# EAGLE schematic ouijabot (EAGLE 9.4.2)
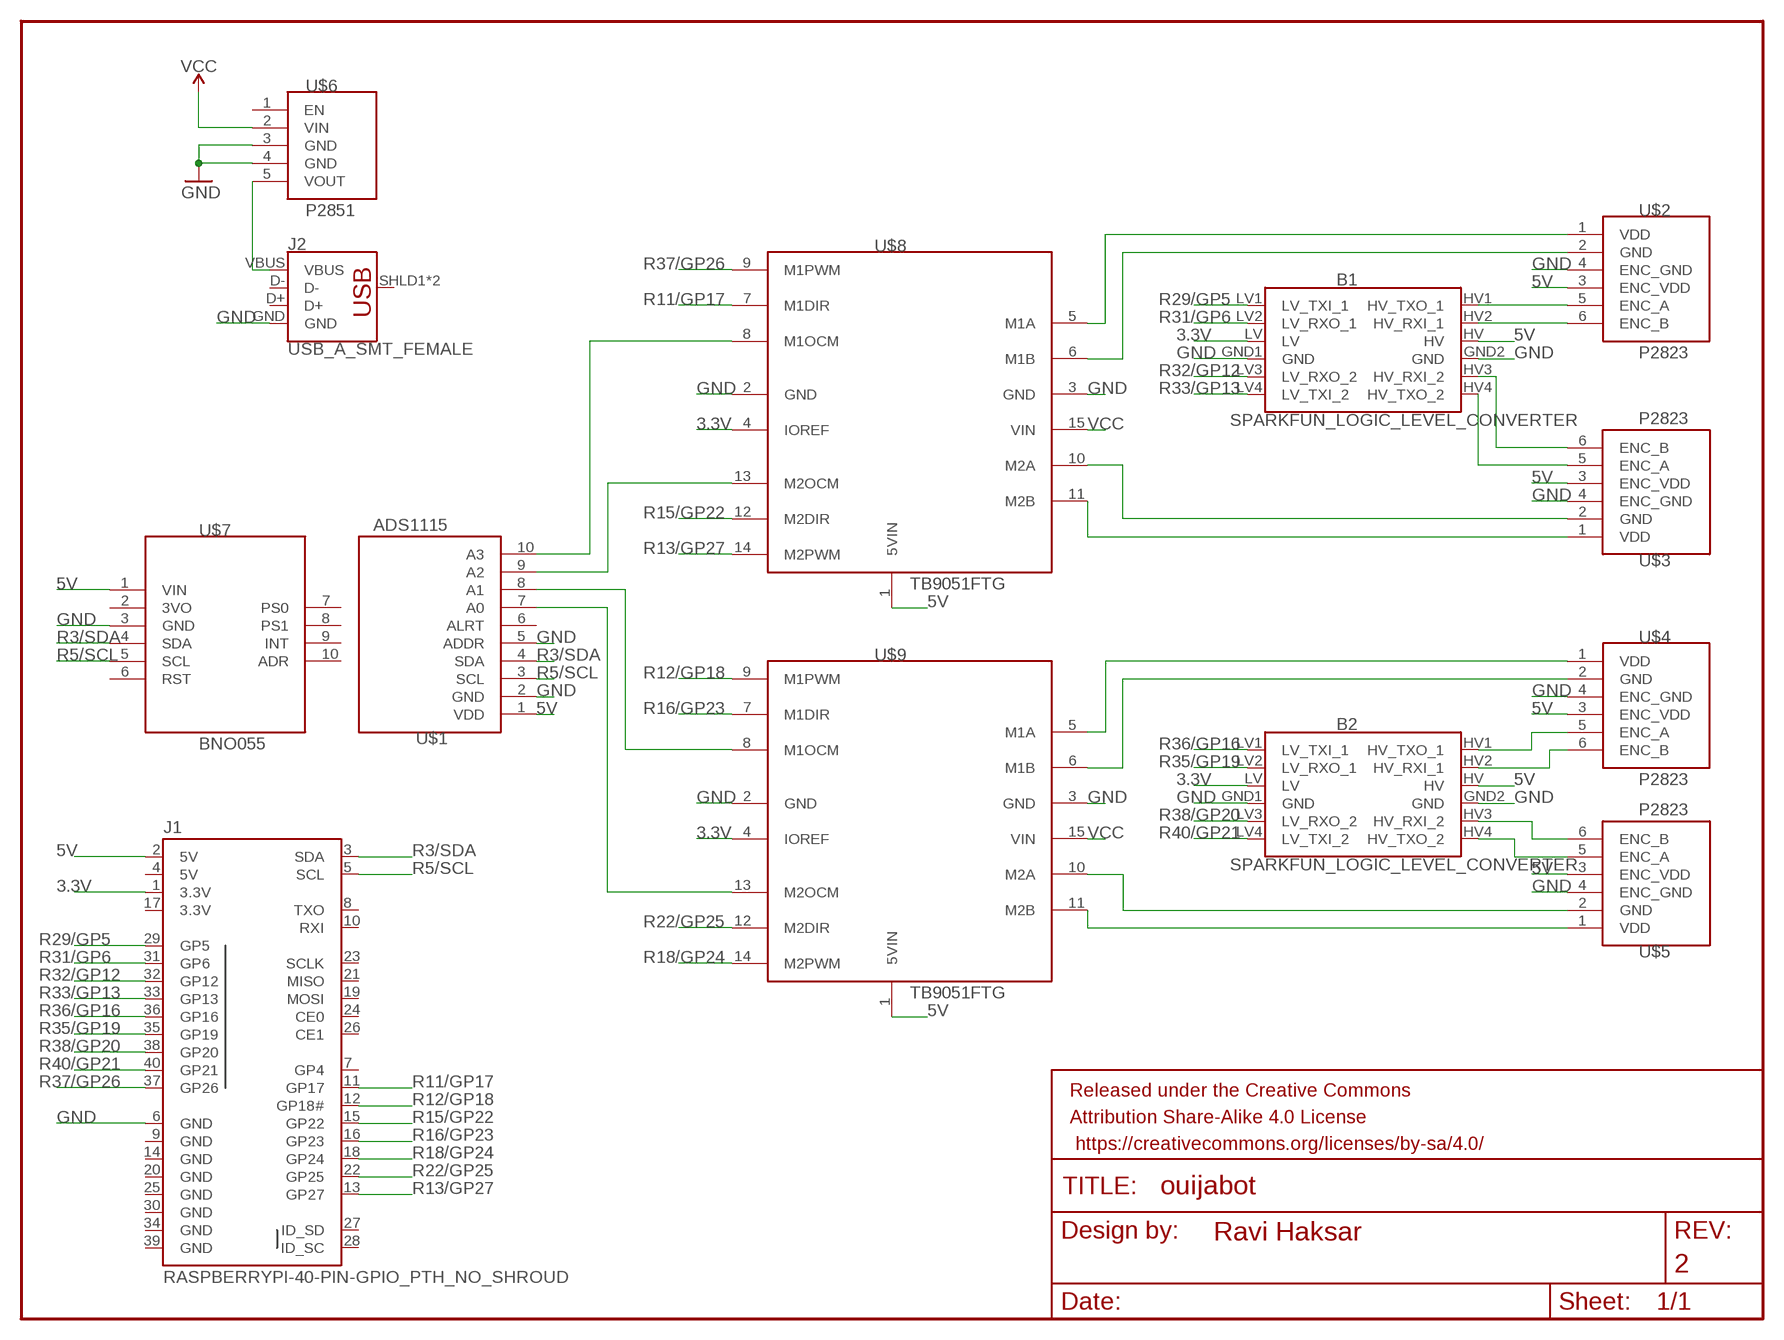
[diagram p0: schematic, sheet 1]

## Parts
B1  SPARKFUN_LOGIC_LEVEL_CONVERTER  [SPARKFUN_LOGIC_LEVEL_CONVERTER]
B2  SPARKFUN_LOGIC_LEVEL_CONVERTER  [SPARKFUN_LOGIC_LEVEL_CONVERTER]
FRAME1  FRAME-LETTER  [CREATIVE_COMMONS]
J1  RASPBERRYPI-40-PIN-GPIO_PTH_NO_SHROUD  [2X20]
J2  USB_A_SMT_FEMALE  [USB-A-S-SILK-FEMALE]
U$1  ADS1115  [10X10MTA]
U$2  P2823  [1X06]
U$3  P2823  [1X06]
U$4  P2823  [1X06]
U$5  P2823  [1X06]
U$6  P2851  [1X05]
U$7  BNO055  [1X10]
U$8  TB9051FTG  [1X15]
U$9  TB9051FTG  [1X15]

## Nets
3.3V: B1.LV B2.LV J1.1(3.3V) U$8.4(IOREF) U$9.4(IOREF)
5V: B1.HV B2.HV J1.2(5V) U$1.1(VDD) U$2.3(ENC_VDD) U$3.3(ENC_VDD) U$4.3(ENC_VDD) U$5.3(ENC_VDD) U$7.1(VIN) U$8.1(5VIN) U$9.1(5VIN)
GND: B1.GND1(GND) B1.GND2(GND) B2.GND1(GND) B2.GND2(GND) J1.6(GND) J2.GND U$1.2(GND) U$1.5(ADDR) U$2.4(ENC_GND) U$3.4(ENC_GND) U$4.4(ENC_GND) U$5.4(ENC_GND) U$6.3(GND) U$6.4(GND) U$7.3(GND) U$8.2(GND) U$8.3(GND) U$9.2(GND) U$9.3(GND)
N$1: J2.VBUS U$6.5(VOUT)
N$2: U$2.1(VDD) U$8.5(M1A)
N$3: U$2.2(GND) U$8.6(M1B)
N$4: B1.HV4(HV_TXO_2) U$3.5(ENC_A)
N$5: U$3.2(GND) U$8.10(M2A)
N$6: B1.HV1(HV_TXO_1) U$2.5(ENC_A)
N$7: B1.HV2(HV_RXI_1) U$2.6(ENC_B)
N$8: B1.HV3(HV_RXI_2) U$3.6(ENC_B)
N$9: U$3.1(VDD) U$8.11(M2B)
N$10: U$4.1(VDD) U$9.5(M1A)
N$11: U$4.2(GND) U$9.6(M1B)
N$12: B2.HV2(HV_RXI_1) U$4.6(ENC_B)
N$13: B2.HV1(HV_TXO_1) U$4.5(ENC_A)
N$14: B2.HV3(HV_RXI_2) U$5.6(ENC_B)
N$15: B2.HV4(HV_TXO_2) U$5.5(ENC_A)
N$16: U$5.2(GND) U$9.10(M2A)
N$17: U$5.1(VDD) U$9.11(M2B)
N$18: U$1.10(A3) U$8.8(M1OCM)
N$19: U$1.9(A2) U$8.13(M2OCM)
N$20: U$1.8(A1) U$9.8(M1OCM)
N$21: U$1.7(A0) U$9.13(M2OCM)
R3/SDA: J1.3(SDA) U$1.4(SDA) U$7.4(SDA)
R5/SCL: J1.5(SCL) U$1.3(SCL) U$7.5(SCL)
R11/GP17: J1.11(GP17) U$8.7(M1DIR)
R12/GP18: J1.12(GP18#) U$9.9(M1PWM)
R13/GP27: J1.13(GP27) U$8.14(M2PWM)
R15/GP22: J1.15(GP22) U$8.12(M2DIR)
R16/GP23: J1.16(GP23) U$9.7(M1DIR)
R18/GP24: J1.18(GP24) U$9.14(M2PWM)
R22/GP25: J1.22(GP25) U$9.12(M2DIR)
R29/GP5: B1.LV1(LV_TXI_1) J1.29(GP5)
R31/GP6: B1.LV2(LV_RXO_1) J1.31(GP6)
R32/GP12: B1.LV3(LV_RXO_2) J1.32(GP12)
R33/GP13: B1.LV4(LV_TXI_2) J1.33(GP13)
R35/GP19: B2.LV2(LV_RXO_1) J1.35(GP19)
R36/GP16: B2.LV1(LV_TXI_1) J1.36(GP16)
R37/GP26: J1.37(GP26) U$8.9(M1PWM)
R38/GP20: B2.LV3(LV_RXO_2) J1.38(GP20)
R40/GP21: B2.LV4(LV_TXI_2) J1.40(GP21)
VCC: U$6.2(VIN) U$8.15(VIN) U$9.15(VIN)
Unconnected: J1.7(GP4) J1.8(TXO) J1.10(RXI) J1.19(MOSI) J1.21(MISO) J1.23(SCLK) J1.24(CE0) J1.26(CE1) J1.27(ID_SD) J1.28(ID_SC) J2.D+ J2.D- J2.SHLD1(SHIELD) J2.SHLD2(SHIELD) U$1.6(ALRT) U$6.1(EN) U$7.2(3VO) U$7.6(RST) U$7.7(PS0) U$7.8(PS1) U$7.9(INT) U$7.10(ADR)

## Power pins joined to a net without a drawn wire
3.3V: J1.17(3.3V)
5V: J1.4(5V)
GND: J1.9(GND) J1.14(GND) J1.20(GND) J1.25(GND) J1.30(GND) J1.34(GND) J1.39(GND)

## Library data of the parts
B1 B2 = SparkFun-Boards:SPARKFUN_LOGIC_LEVEL_CONVERTER: SparkFun Logic Level Converter -Bi-Directional This is the mechnical outline for the 3.3V - 5V bi directional logic level converter. *Note, the "LOCK" Package has the header pins staggered by an offset of 5 mils (off center line), so that when you slide a row of standard 0.1" headers into the PTH pads, it will hold position vertically. See the follwing turorial for more information on this type of special footprints: Sneaky Footprints <https://www.sparkfun.com/tutorials/114> SparkFun Products: SparkFun Logic Level Converter - Bi-Directional <https://www.sparkfun.com/products/12009>
FRAME1 = SparkFun-Aesthetics:FRAME-LETTER: Schematic Frame - Letter Standard 8.5x11 US Letter frame; DESIGNER: Ravi Haksar; REV: 2
J1 = SparkFun-Connectors:RASPBERRYPI-40-PIN-GPIO: Raspberry Pi GPIO Header 2x20 pin connector, as found on B, B+, A+ models. Both shrouded PTH and SMT versions available. SparkFun Products: GPIO Shrouded Header <https://www.sparkfun.com/products/13054>- PTH SparkFun Pi Wedge (Preassembled) <https://www.sparkfun.com/products/13717>
J2 = SparkFun-Connectors:USB_A: USB-A Connector Male and female variants, as well as PTH and SMT variants SparkFun Products: SparkFun XBee Explorer Dongle <https://www.sparkfun.com/products/11697> PTH Male SparkFun MicroView-USB Programmer <https://www.sparkfun.com/products/12924> SMT Male SparkFun USB Type A Female Breakout <https://www.sparkfun.com/products/12700> SMT Female; PROD_ID: CONN-09520; SF_ID: PRT-09011
U$1 = ouijabot:ADS1115: ADS1115 16-Bit ADC - 4 Channel with Programmable Gain Amplifier: https://www.adafruit.com/product/1085
U$2-U$5 = ouijabot:P2823: 30:1 Metal Gearmotor 37Dx68L mm with 64 CPR Encoder (Spur Pinion): https://www.pololu.com/product/2823
U$6 = ouijabot:P2851: Pololu 5V, 5A Step-Down Voltage Regulator D24V50F5: https://www.pololu.com/product/2851
U$7 = ouijabot:BNO055: Adafruit 9-DOF Absolute Orientation IMU Fusion Breakout - BNO055: https://www.adafruit.com/product/2472
U$8 U$9 = ouijabot:TB9051FTG: Dual TB9051FTG Motor Driver Shield for Arduino: https://www.pololu.com/product/2520